# Altium schematic sheet 1.POWER.SchDoc
size A4; SheetNumber: 5; SheetTotal: 5
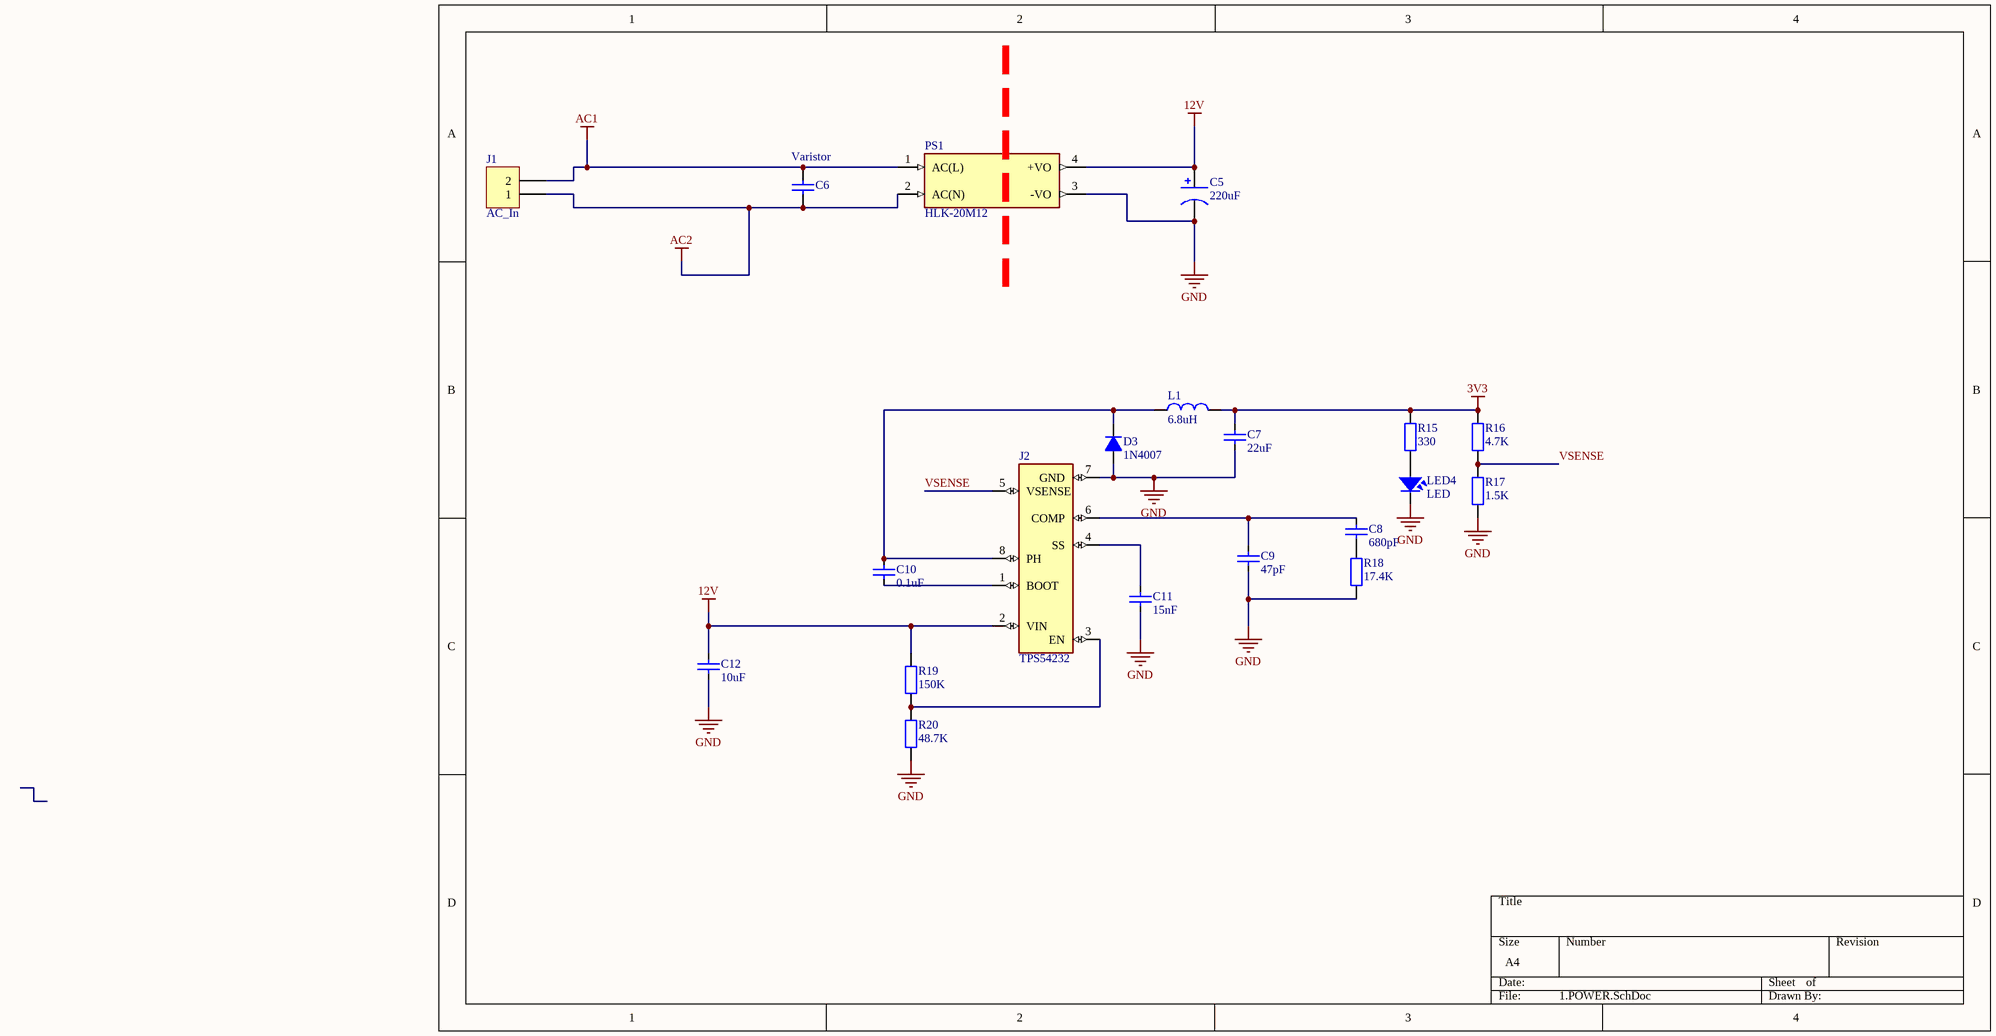
[diagram p0: 1.POWER.SchDoc]

## Parts
C5  220uF  [C3MM]
C6  Varistor  [CAP_CERAMIC]
C7  22uF  [CAP_0805]
C8  680pF  [CAP_0805]
C9  47pF  [CAP_0805]
C10  0.1uF  [CAP_0805]
C11  15nF  [CAP_0805]
C12  10uF  [CAP_0805]
D3  1N4007  [DIO-214AC(SMA)]
J1  AC_In  [KF2-5.08T]
J2  TPS54232  [SOIC8]
L1  6.8uH  [L-SMD-M-12x10]
LED4  LED  [LED_RED_SMD_0805]
PS1  HLK-20M12  [CONV_HLK-20M12]
R15  330  [RES-SMD-0805]
R16  4.7K  [RES-SMD-0805]
R17  1.5K  [RES-SMD-0805]
R18  17.4K  [RES-SMD-0805]
R19  150K  [RES-SMD-0805]
R20  48.7K  [RES-SMD-0805]

## Nets
3V3: C7.1 L1.2 R15.2 R16.2
12V: C5.1 C12.1 J2.2(VIN) PS1.4(+VO) R19.2
AC1: C6.1 J1.2 PS1.1(AC(L))
AC2: C6.2 J1.1 PS1.2(AC(N))
GND: C5.2 C7.2 C9.2 C11.2 C12.2 D3.1(A) J2.7(GND) LED4.2 PS1.3(-VO) R17.1 R18.1 R20.1
VSENSE: J2.5(VSENSE) R16.1 R17.2
NetC8_1: C8.1 C9.1 J2.6(COMP)
NetC8_2: C8.2 R18.2
NetC10_1: C10.1 D3.2(K) J2.8(PH) L1.1
NetC10_2: C10.2 J2.1(BOOT)
NetC11_1: C11.1 J2.4(SS)
NetJ2_3: J2.3(EN) R19.1 R20.2
NetLED4_1: LED4.1 R15.1

## Library data of the parts
C5 = Cap Pol: Polarized Capacitor (Axial); Published: 8-Jun-2000; LatestRevisionDate: 17-Jul-2002; LatestRevisionNote: Re-released for DXP Platform.; PackageReference: POLAR0.8; Publisher: Altium Limited
C6 = CapCeramic: Capacitor; Value: 33p; Published: 8-Jun-2000; LatestRevisionDate: 17-Jul-2002; LatestRevisionNote: Re-released for DXP Platform.; PackageReference: RAD-0.3; Publisher: Altium Limited
C7-C12 = CapSMD: Capacitor; Value: 33p; Published: 8-Jun-2000; LatestRevisionDate: 17-Jul-2002; LatestRevisionNote: Re-released for DXP Platform.; PackageReference: RAD-0.3; Publisher: Altium Limited
D3 = D1A: Diode 1A; Value: 1N4007
J1 = KF2: Manufacturer: Würth Elektronik eiSos GmbH; partNo: 691103110002; ComponentLink1 Description: Manufacturer; ComponentLink2 Description: Datasheet; NoPins: 2; Created Date: 29 October 2013; ComponentLink1URL: http://www.we-online.com; ComponentLink2URL: http://katalog.we-online.de/em/datasheet/6911031100xx.pdf; Created by: Karrer Zheng
J2 = TPS54232: Buck Switching Regulator IC Positive Adjustable 0.8V 1 Output 2A 8-SOIC (0.154, 3.90mm Width); MF: Texas Instruments; SnapEDA_Link: https://www.snapeda.com/parts/TPS54232/Texas+Instruments/view-part/?ref=snap; Package: - Texas Instruments; Value: *; MP: TPS54232; Check_prices: https://www.snapeda.com/parts/TPS54232/Texas+Instruments/view-part/?ref=eda
L1 = Inductor: Value: 150 mH
LED4 = LED: LED Single colour Green and Red; Value: LED 3 ly Single Colour
PS1 = HLK-20M12: 20W ultra-small series module power supply; MF: Hi-link; Check_prices: https://www.snapeda.com/parts/HLK-20M12/Hi-link/view-part/?ref=eda; SnapEDA_Link: https://www.snapeda.com/parts/HLK-20M12/Hi-link/view-part/?ref=snap; Availability: Not in stock; Price: None; Value: *; MP: HLK-20M12; Package: Non-Standard Hi-link
R15-R20 = Resistor - SMD: Resistor SMD; Manufacturer: Generic Components; Class: Passive; Published: 08/06/2000; Publisher: Altium Hobart Technology Centre